# Altium schematic sheet MASTER.SchDoc: Mouse Development Board Master Sheet
size A4; SheetNumber: 1; SheetTotal: 5; ENG_APP_DATE: --/--/--; DSN_APP_DATE: --/--/--; CHK_APP_DATE: --/--/--
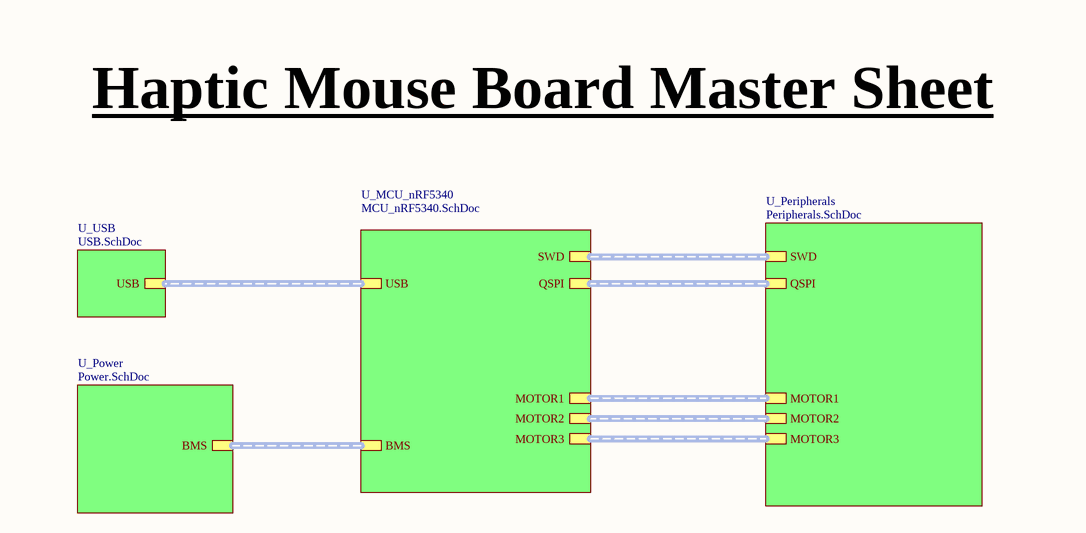
[diagram p0: MASTER.SchDoc]

## Sub-sheets
U_MCU_nRF5340 = MCU_nRF5340.SchDoc: SWD (harness STLINK), USB (harness USB), QSPI (harness QSPI), BMS (harness BMS), MOTOR1 (harness MOTOR), MOTOR2 (harness MOTOR), MOTOR3 (harness MOTOR)
U_Peripherals = Peripherals.SchDoc: SWD (harness STLINK), QSPI (harness QSPI), MOTOR1 (harness MOTOR), MOTOR2 (harness MOTOR), MOTOR3 (harness MOTOR)
U_Power = Power.SchDoc: BMS (harness BMS)
U_USB = USB.SchDoc: USB (harness USB)

## Buses and harness runs
harness sheet U_MCU_nRF5340/BMS = sheet U_Power/BMS
harness sheet U_MCU_nRF5340/MOTOR1 = sheet U_Peripherals/MOTOR1
harness sheet U_MCU_nRF5340/MOTOR2 = sheet U_Peripherals/MOTOR2
harness sheet U_MCU_nRF5340/MOTOR3 = sheet U_Peripherals/MOTOR3
harness sheet U_MCU_nRF5340/QSPI = sheet U_Peripherals/QSPI
harness sheet U_MCU_nRF5340/SWD = sheet U_Peripherals/SWD
harness sheet U_MCU_nRF5340/USB = sheet U_USB/USB

## Notes on the sheet
- Haptic Mouse Board Master Sheet
- DWG. NO.
- REV.
- SHT.
- THIS DOCUMENT AND THE DATA DISCLOSED HEREIN OR HEREWITH IS THE PROPERTY OF ALTIUM LIMITED AND MAY BE FREELY DISTRIBUTED IN WHOLE. NO RIGHTS ARE RESERVED OR EXPRESS OR IMPLIED WARANTEE GIVEN.
- REVISION
- DESCRIPTION
- DATE
- APPROVED
- ENG:
- APPROVALS
- PROJECT
- DSN:
- CHK:
- REFERENCE DOCUMENTS
- PROJECT REVISION:
- TITLE
- DOCUMENT REVISION:
- DESIGN ITEM:
- BOM:
- FAB DWG:
- PCB DWG:
- ASSY DWG:
- SCALE:
- SIZE
- B
- CAGE CODE
- FILE NAME
- DWG NO.
- SHEET
- OF
- REV